# Altium schematic sheet IndAlarmIf2.SCHDOC
size B
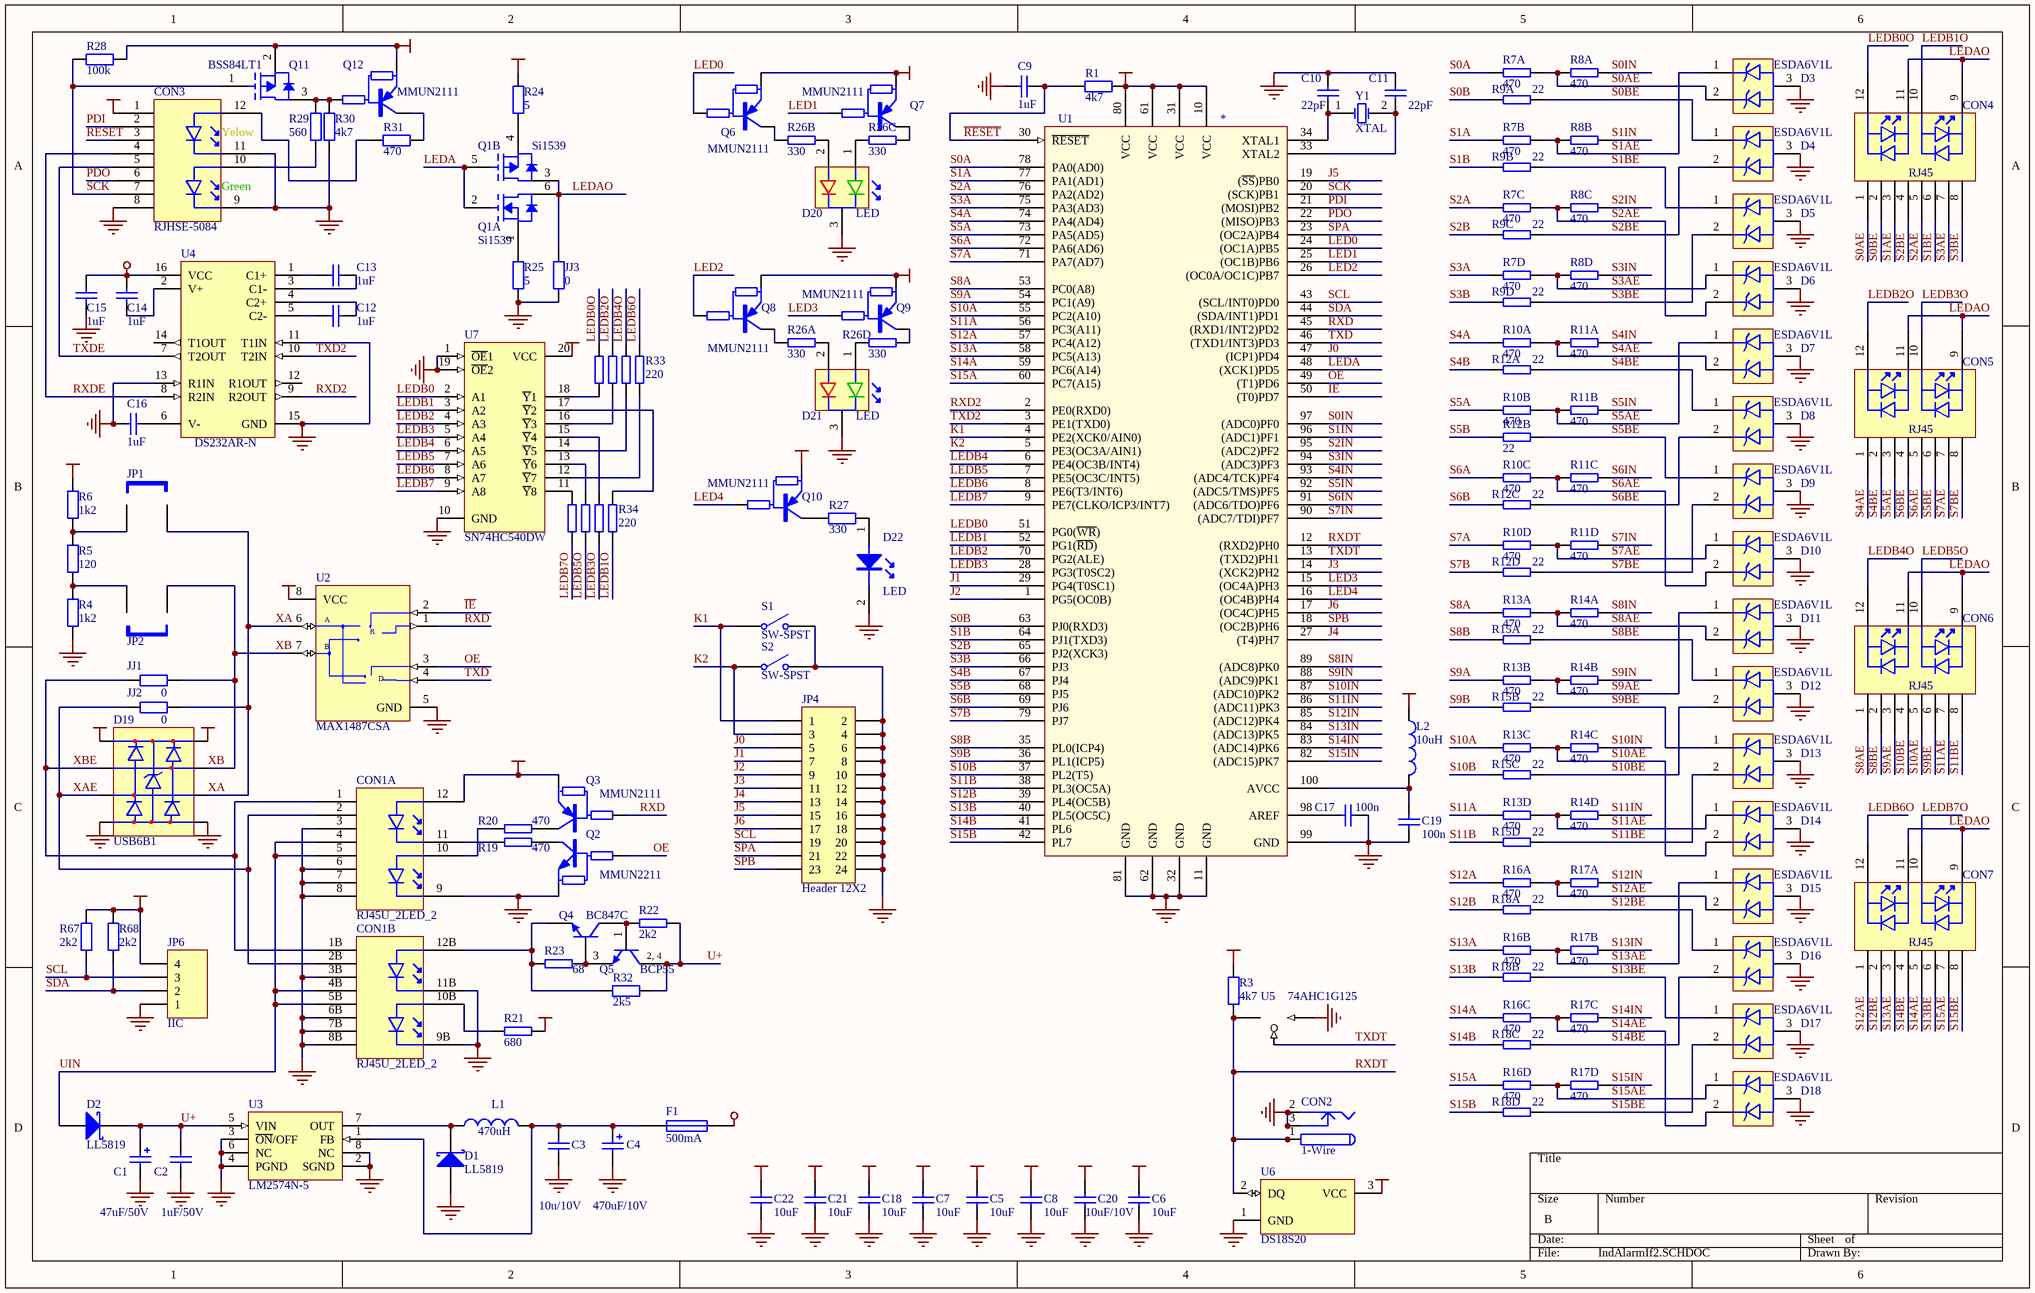
[diagram p0: IndAlarmIf2.SCHDOC]

## Parts
C1  value 47uF/50V  [C8X11RM3.5]  (hidden comment: Cap Pol1)
C2  value 1uF/50V  [CC3225-1210]  (hidden comment: Cap Semi)
C3  value 10u/10V  [CC3225-1210]  (hidden comment: Cap Semi)
C4  value 470uF/10V  [C8X11RM3.5]  (hidden comment: Cap Pol1)
C5  value 10uF  [CC3216-1206]  (hidden comment: Cap Semi)
C6  value 10uF  [CC3216-1206]  (hidden comment: Cap Semi)
C7  value 10uF  [CC3216-1206]  (hidden comment: Cap Semi)
C8  value 10uF  [CC3225-1210]  (hidden comment: Cap Semi)
C9  value 1uF  [CC2012-0805]  (hidden comment: Cap Semi)
C10  value 22pF  [CC2012-0805]  (hidden comment: Cap Semi)
C11  value 22pF  [CC2012-0805]  (hidden comment: Cap Semi)
C12  value 1uF  [CC2012-0805]  (hidden comment: Cap Semi)
C13  value 1uF  [CC2012-0805]  (hidden comment: Cap Semi)
C14  value 1uF  [CC2012-0805]  (hidden comment: Cap Semi)
C15  value 1uF  [CC3216-1206]  (hidden comment: Cap Semi)
C16  value 1uF  [CC2012-0805]  (hidden comment: Cap Semi)
C17  value 100n  [CC2012-0805]  (hidden comment: Cap Semi)
C18  value 10uF  [CC3216-1206]  (hidden comment: Cap Semi)
C19  value 100n  [CC3216-1206]  (hidden comment: Cap Semi)
C20  value 10uF/10V  [CC3216-1206]  (hidden comment: Cap Semi)
C21  value 10uF  [CC3216-1206]  (hidden comment: Cap Semi)
C22  value 10uF  [CC3216-1206]  (hidden comment: Cap Semi)
CON1  RJ45U_2LED_2  [RJHS-508x-2]  (parts A,B of 2)
CON2  1-Wire  [KLD-0202]
CON3  RJHSE-5084  [RJHS-508x]
CON4  RJ45  [RJHS-508x]
CON5  RJ45  [RJHS-508x]
CON6  RJ45  [RJHS-508x]
CON7  RJ45  [RJHS-508x]
D1  LL5819  [MELF]
D2  LL5819  [MELF]
D3  ESDA6V1L  [SO-G3/C2.5]
D4  ESDA6V1L  [SO-G3/C2.5]
D5  ESDA6V1L  [SO-G3/C2.5]
D6  ESDA6V1L  [SO-G3/C2.5]
D7  ESDA6V1L  [SO-G3/C2.5]
D8  ESDA6V1L  [SO-G3/C2.5]
D9  ESDA6V1L  [SO-G3/C2.5]
D10  ESDA6V1L  [SO-G3/C2.5]
D11  ESDA6V1L  [SO-G3/C2.5]
D12  ESDA6V1L  [SO-G3/C2.5]
D13  ESDA6V1L  [SO-G3/C2.5]
D14  ESDA6V1L  [SO-G3/C2.5]
D15  ESDA6V1L  [SO-G3/C2.5]
D16  ESDA6V1L  [SO-G3/C2.5]
D17  ESDA6V1L  [SO-G3/C2.5]
D18  ESDA6V1L  [SO-G3/C2.5]
D19  USB6B1  [NSO8]
D20  LED  [LED3mm - 2]
D21  LED  [LED3mm - 2]
D22  LED  [LED3mm]
F1  500mA  [minifuse]
JJ1  value 0  [CR2012-0805]
JJ2  value 0  [CR2012-0805]
JJ3  value 0  [CR2012-0805]
JP1  Jumper  [JP]  (value not drawn)
JP2  Jumper  [JP]  (value not drawn)
JP4  Header 12X2  [HDR2X12]
JP6  IIC  [HDR1X4]
L1  value 470uH  [SSL1306T - NPI27H]  (hidden comment: Inductor)
L2  value 10uH  [CR3225-1210]  (hidden comment: Inductor)
Q1  Si1539  [SOT363]  (parts A,B of 2)
Q2  MMUN2211  [SOT-23]
Q3  MMUN2111  [SOT-23]
Q4  BC847C  [318-08]
Q5  BCP55  [SOT223]
Q6  MMUN2111  [SOT-23]
Q7  MMUN2111  [SOT-23]
Q8  MMUN2111  [SOT-23]
Q9  MMUN2111  [SOT-23]
Q10  MMUN2111  [SOT-23]
Q11  BSS84LT1  [SOT23]
Q12  MMUN2111  [SOT-23]
R1  value 4k7  [CR2012-0805]  (hidden comment: Res Semi)
R3  value 4k7  [CR2012-0805]  (hidden comment: Res Semi)
R4  value 1k2  [CR2012-0805]  (hidden comment: Res Semi)
R5  value 120  [CR5025-2010]  (hidden comment: Res Semi)
R6  value 1k2  [CR2012-0805]  (hidden comment: Res Semi)
R7  470  [YC164]  (parts A,B,C,D of 4)
R8  470  [YC164]  (parts A,B,C,D of 4)
R9  22  [YC164]  (parts A,B,C,D of 4)
R10  470  [YC164]  (parts A,B,C,D of 4)
R11  470  [YC164]  (parts A,B,C,D of 4)
R12  22  [YC164]  (parts A,B,C,D of 4)
R13  470  [YC164]  (parts A,B,C,D of 4)
R14  470  [YC164]  (parts A,B,C,D of 4)
R15  22  [YC164]  (parts A,B,C,D of 4)
R16  470  [YC164]  (parts A,B,C,D of 4)
R17  470  [YC164]  (parts A,B,C,D of 4)
R18  22  [YC164]  (parts A,B,C,D of 4)
R19  470  [CR2012-0805]
R20  470  [CR2012-0805]
R21  680  [CR2012-0805]
R22  2k2  [CR2012-0805]
R23  68  [CR2012-0805]
R24  value 5  [CR5025-2010]  (hidden comment: Res Semi)
R25  value 5  [CR5025-2010]  (hidden comment: Res Semi)
R26  330  [YC164]  (parts A,B,C,D of 4)
R27  value 330  [CR2012-0805]  (hidden comment: Res Semi)
R28  value 100k  [CR2012-0805]  (hidden comment: Res Semi)
R29  value 560  [CR2012-0805]  (hidden comment: Res Semi)
R30  value 4k7  [CR2012-0805]  (hidden comment: Res Semi)
R31  value 470  [CR2012-0805]  (hidden comment: Res Semi)
R32  value 2k5  [CR5025-2010]  (hidden comment: Res Semi)
R33  220  [YC164]
R34  220  [YC164]
R67  value 2k2  [CR2012-0805]  (hidden comment: Res Semi)
R68  value 2k2  [CR2012-0805]  (hidden comment: Res Semi)
S1  SW-SPST  [AXIAL-0.6]
S2  SW-SPST  [AXIAL-0.6]
U1  *  [TQFP100]
U2  MAX1487CSA  [NSO8]
U3  LM2574N-5  [626-05]
U4  DS232AR-N  [SOIC16N]
U5  74AHC1G125  [SOT353]
U6  DS18S20  [PR35]
U7  SN74HC540DW  [DW020]
Y1  XTAL  [HC49]

## Nets
GND: C1.2 C2.1 C3.1 C4.2 C5.1 C6.1 C7.1 C8.1 C9.2 C10.2 C11.2 C15.2 C16.1 C17.1 C18.1 C19.1 C20.1 C21.1 C22.1 CON1.3 CON1.3B CON1.6 CON1.6B CON1.7 CON1.7B CON1.8 CON1.8B CON1.9 CON1.9B CON1.11B CON2.2 CON2.2A CON2.2B CON2.3 CON2.3A CON2.3B CON3.8 CON3.9 CON3.11 D1.1(A) D3.3 D4.3 D5.3 D6.3 D7.3 D8.3 D9.3 D10.3 D11.3 D12.3 D13.3 D14.3 D15.3 D16.3 D17.3 D18.3 D19.4(GND) D19.5(GND) D20.3 D21.3 D22.2 JJ3.1 JP4.2 JP4.4 JP4.6 JP4.8 JP4.10 JP4.12 JP4.14 JP4.16 JP4.18 JP4.20 JP4.22 JP4.24 JP6.1 Q2.2(E) R4.1 R25.1 R30.1 S1.2(NO) S2.2(NO) U1.11(GND) U1.32(GND) U1.62(GND) U1.81(GND) U1.99(GND) U2.5(GND) U3.2(SGND) U3.3(~{ON}/OFF) U3.4(PGND) U3.6(NC) U3.8(NC) U4.11(T1IN) U4.13(R1IN) U4.15(GND) U5.2(A) U5.3(GND) U6.1(GND) U7.1(~{OE}1) U7.10(GND) U7.19(~{OE}2)
VCC: C5.2 C6.2 C7.2 C8.2 C14.1 C15.1 C18.2 C20.2 C21.2 C22.2 CON1.12 CON3.1 D19.1(VCC) D19.8(VCC) F1.2 JP6.4 L2.1 Q3.2(E) Q6.2(E) Q7.2(E) Q8.2(E) Q9.2(E) Q10.2(E) Q11.2(S) Q12.2(E) R1.2 R3.2 R6.1 R21.2 R24.2 R28.2 R67.2 R68.2 U1.10(VCC) U1.31(VCC) U1.61(VCC) U1.80(VCC) U2.8(VCC) U4.16(VCC) U5.5(VCC) U6.3(VCC) U7.20(VCC)
~{IE}: U1.50((T0)PD7) U2.2(~{RE})
J0: JP4.5 U1.47((ICP1)PD4)
J1: JP4.7 U1.29(PG4(T0SC1))
J2: JP4.9 U1.1(PG5(OC0B))
J3: JP4.11 U1.14((XCK2)PH2)
J4: JP4.13 U1.27((T4)PH7)
J5: JP4.15 U1.19((~{SS})PB0)
J6: JP4.17 U1.17((OC4C)PH5)
K1: JP4.1 S1.1(COMMON) U1.4(PE2(XCK0/AIN0))
K2: JP4.3 S2.1(COMMON) U1.5(PE3(OC3A/AIN1))
LED0: Q6.1(B) U1.24((OC1A)PB5)
LED1: Q7.1(B) U1.25((OC1B)PB6)
LED2: Q8.1(B) U1.26((OC0A/OC1C)PB7)
LED3: Q9.1(B) U1.15((OC4A)PH3)
LED4: Q10.1(B) U1.16((OC4B)PH4)
LEDA: Q1.2(G1) Q1.5(G2) U1.48((XCK1)PD5)
LEDAO: CON4.9 CON4.11 CON5.9 CON5.11 CON6.9 CON6.11 CON7.9 CON7.11 JJ3.2 Q1.3(D2) Q1.6(D1)
LEDB0: U1.51(PG0(~{WR})) U7.2(A1)
LEDB0O: CON4.12 R33.8
LEDB1: U1.52(PG1(~{RD})) U7.3(A2)
LEDB1O: CON4.10 R34.5
LEDB2: U1.70(PG2(ALE)) U7.4(A3)
LEDB2O: CON5.12 R33.7
LEDB3: U1.28(PG3(T0SC2)) U7.5(A4)
LEDB3O: CON5.10 R34.6
LEDB4: U1.6(PE4(OC3B/INT4)) U7.6(A5)
LEDB4O: CON6.12 R33.6
LEDB5: U1.7(PE5(OC3C/INT5)) U7.7(A6)
LEDB5O: CON6.10 R34.7
LEDB6: U1.8(PE6(T3/INT6)) U7.8(A7)
LEDB6O: CON7.12 R33.5
LEDB7: U1.9(PE7(CLKO/ICP3/INT7)) U7.9(A8)
LEDB7O: CON7.10 R34.8
OE: Q2.1(B) U1.49((T1)PD6) U2.3(DE)
PDI: CON3.2 U1.21((MOSI)PB2)
PDO: CON3.6 U1.22((MISO)PB3)
~{RESET}: C9.1 CON3.3 R1.1 U1.30(~{RESET})
RXD: Q3.1(B) U1.45((RXD1/INT2)PD2) U2.1(RO)
RXD2: U1.2(PE0(RXD0)) U4.9(R2OUT)
RXDE: CON3.4 U4.8(R2IN)
RXDT: CON2.1 CON2.1A CON2.1B R3.1 U1.12((RXD2)PH0) U5.4(Y) U6.2(DQ)
S0A: R7.8 U1.78(PA0(AD0))
S0AE: CON4.1 D3.2 R7.1 R8.8
S0B: R9.1 U1.63(PJ0(RXD3))
S0BE: CON4.2 D4.1 R9.8
S0IN: R8.1 U1.97((ADC0)PF0)
S1A: R7.7 U1.77(PA1(AD1))
S1AE: CON4.3 D3.1 R7.2 R8.7
S1B: R9.2 U1.64(PJ1(TXD3))
S1BE: CON4.6 D5.1 R9.7
S1IN: R8.2 U1.96((ADC1)PF1)
S2A: R7.6 U1.76(PA2(AD2))
S2AE: CON4.5 D6.2 R7.3 R8.6
S2B: R9.3 U1.65(PJ2(XCK3))
S2BE: CON4.4 D4.2 R9.6
S2IN: R8.3 U1.95((ADC2)PF2)
S3A: R7.5 U1.75(PA3(AD3))
S3AE: CON4.7 D6.1 R7.4 R8.5
S3B: R9.4 U1.66(PJ3)
S3BE: CON4.8 D5.2 R9.5
S3IN: R8.4 U1.94((ADC3)PF3)
S4A: R10.8 U1.74(PA4(AD4))
S4AE: CON5.1 D7.2 R10.1 R11.8
S4B: R12.1 U1.67(PJ4)
S4BE: CON5.2 D8.1 R12.8
S4IN: R11.1 U1.93((ADC4/TCK)PF4)
S5A: R10.7 U1.73(PA5(AD5))
S5AE: CON5.3 D7.1 R10.2 R11.7
S5B: R12.2 U1.68(PJ5)
S5BE: CON5.6 D9.1 R12.7
S5IN: R11.2 U1.92((ADC5/TMS)PF5)
S6A: R10.6 U1.72(PA6(AD6))
S6AE: CON5.5 D10.2 R10.3 R11.6
S6B: R12.3 U1.69(PJ6)
S6BE: CON5.4 D8.2 R12.6
S6IN: R11.3 U1.91((ADC6/TDO)PF6)
S7A: R10.5 U1.71(PA7(AD7))
S7AE: CON5.7 D10.1 R10.4 R11.5
S7B: R12.4 U1.79(PJ7)
S7BE: CON5.8 D9.2 R12.5
S7IN: R11.4 U1.90((ADC7/TDI)PF7)
S8A: R13.8 U1.53(PC0(A8))
S8AE: CON6.1 D11.2 R13.1 R14.8
S8B: R15.1 U1.35(PL0(ICP4))
S8BE: CON6.2 D12.1 R15.8
S8IN: R14.1 U1.89((ADC8)PK0)
S9A: R13.7 U1.54(PC1(A9))
S9AE: CON6.3 D11.1 R13.2 R14.7
S9B: R15.2 U1.36(PL1(ICP5))
S9BE: CON6.6 D13.1 R15.7
S9IN: R14.2 U1.88((ADC9)PK1)
S10A: R13.6 U1.55(PC2(A10))
S10AE: CON6.5 D14.2 R13.3 R14.6
S10B: R15.3 U1.37(PL2(T5))
S10BE: CON6.4 D12.2 R15.6
S10IN: R14.3 U1.87((ADC10)PK2)
S11A: R13.5 U1.56(PC3(A11))
S11AE: CON6.7 D14.1 R13.4 R14.5
S11B: R15.4 U1.38(PL3(OC5A))
S11BE: CON6.8 D13.2 R15.5
S11IN: R14.4 U1.86((ADC11)PK3)
S12A: R16.8 U1.57(PC4(A12))
S12AE: CON7.1 D15.2 R16.1 R17.8
S12B: R18.1 U1.39(PL4(OC5B))
S12BE: CON7.2 D16.1 R18.8
S12IN: R17.1 U1.85((ADC12)PK4)
S13A: R16.7 U1.58(PC5(A13))
S13AE: CON7.3 D15.1 R16.2 R17.7
S13B: R18.2 U1.40(PL5(OC5C))
S13BE: CON7.6 D17.1 R18.7
S13IN: R17.2 U1.84((ADC13)PK5)
S14A: R16.6 U1.59(PC6(A14))
S14AE: CON7.5 D18.2 R16.3 R17.6
S14B: R18.3 U1.41(PL6)
S14BE: CON7.4 D16.2 R18.6
S14IN: R17.3 U1.83((ADC14)PK6)
S15A: R16.5 U1.60(PC7(A15))
S15AE: CON7.7 D18.1 R16.4 R17.5
S15B: R18.4 U1.42(PL7)
S15BE: CON7.8 D17.2 R18.5
S15IN: R17.4 U1.82((ADC15)PK7)
SCK: CON3.7 Q11.1(G) R28.1 U1.20((SCK)PB1)
SCL: JP4.19 JP6.3 R67.1 U1.43((SCL/INT0)PD0)
SDA: JP6.2 R68.1 U1.44((SDA/INT1)PD1)
SPA: JP4.21 U1.23((OC2A)PB4)
SPB: JP4.23 U1.18((OC2B)PH6)
TXD: U1.46((TXD1/INT3)PD3) U2.4(DI)
TXD2: U1.3(PE1(TXD0)) U4.10(T2IN)
TXDE: CON3.5 U4.7(T2OUT)
TXDT: U1.13((TXD2)PH1) U5.1(~{OE})
U+: C1.1 C2.2 D2.2(K) Q5.2(C) Q5.4(C) R22.2 R32.1 U3.5(VIN)
UIN: CON1.4 CON1.4B CON1.5 CON1.5B D2.1(A)
XA: D19.3(I/O2) JJ2.2 JP1.2 U2.6(A)
XAE: CON1.2 CON1.2B D19.6(I/O2) JJ2.1
XB: D19.2(I/O1) JJ1.2 JP2.1 U2.7(B)
XBE: CON1.1 CON1.1B D19.7(I/O1) JJ1.1
NetC3_2: C3.2 C4.1 F1.1 L1.2 U3.1(FB)
NetC10_1: C10.1 U1.34(XTAL1) Y1.1(OSC1)
NetC11_1: C11.1 U1.33(XTAL2) Y1.2(OSC2)
NetC12_1: C12.1 U4.5(C2-)
NetC12_2: C12.2 U4.4(C2+)
NetC13_1: C13.1 U4.1(C1+)
NetC13_2: C13.2 U4.3(C1-)
NetC14_2: C14.2 U4.2(V+)
NetC16_2: C16.2 U4.6(V-)
NetC17_2: C17.2 U1.98(AREF)
NetC19_2: C19.2 L2.2 U1.100(AVCC)
NetCON1_10: CON1.10 R20.1
NetCON1_10B: CON1.10B R21.1
NetCON1_11: CON1.11 R19.1
NetCON1_12B: CON1.12B Q4.2(E) R23.1 R32.2
NetCON3_10: CON3.10 R29.1
NetCON3_12: CON3.12 R31.1
NetD1_2: D1.2(K) L1.1 U3.7(OUT)
NetD20_1: D20.1 R26.3
NetD20_2: D20.2 R26.2
NetD21_1: D21.1 R26.4
NetD21_2: D21.2 R26.1
NetD22_1: D22.1 R27.1
NetJP1_1: JP1.1 R5.2 R6.2
NetJP2_2: JP2.2 R4.2 R5.1
NetQ1_1: Q1.1(S1) R25.2
NetQ1_4: Q1.4(S2) R24.1
NetQ2_3: Q2.3(C) R19.2
NetQ3_3: Q3.3(C) R20.2
NetQ4_1: Q4.1(B) Q5.3(E) R23.2
NetQ4_3: Q4.3(C) Q5.1(B) R22.1
NetQ6_3: Q6.3(C) R26.7
NetQ7_3: Q7.3(C) R26.6
NetQ8_3: Q8.3(C) R26.8
NetQ9_3: Q9.3(C) R26.5
NetQ10_3: Q10.3(C) R27.2
NetQ11_3: Q11.3(D) Q12.1(B) R29.2 R30.2
NetQ12_3: Q12.3(C) R31.2
NetR33_1: R33.1 U7.18(~{Y}1)
NetR33_2: R33.2 U7.16(~{Y}3)
NetR33_3: R33.3 U7.14(~{Y}5)
NetR33_4: R33.4 U7.12(~{Y}7)
NetR34_1: R34.1 U7.11(~{Y}8)
NetR34_2: R34.2 U7.13(~{Y}6)
NetR34_3: R34.3 U7.15(~{Y}4)
NetR34_4: R34.4 U7.17(~{Y}2)

Not connected (* = marked no-connect by the designer): U4 12(R1OUT) 14(T1OUT)

## Notes on the sheet
- (near CON3) Yelow
- (near CON3) Green
- (in symbol BCP55) 2, 4
- (in symbol MAX1487CSA) R; D

## Library data of the parts
C1 C4 = Cap Pol1: Polarized Capacitor (Radial); Published: 8-Jun-2000; Revision: July-2002: Re-released for DXP Platform.; Publisher: Altium Limited
C2 C3 C5-C22 = Cap Semi: Capacitor (Semiconductor SIM Model); Published: 8-Jun-2000; Revision: July-2002: Re-released for DXP Platform.; Publisher: Altium Limited
CON2 = PWR2.5: Low Voltage Power Supply Connector; Published: 17-Dec-2003; Datasheet: Latest Revision: 09-May-2002; Publisher: Altium Limited
CON3 = RJ45U_2LED
CON4-CON7 = RJ45U_2LED_BI
D1 D2 = D Schottky: Schottky Diode; Code - JEDEC: DO-214-AA; Published: 8-Jun-2000; Revision: July-2002: Re-released for DXP Platform.; Publisher: Altium Limited
D3-D18 = ESDA6V1L: DUAL TRANSIL ARRAY / FOR ESD PROTECTION
D20 D21 = 2LED_A
D22 = LED12
F1 = Fuse 1: Fuse; Published: 8-Jun-2000; Revision: July-2002: Re-released for DXP Platform.; Publisher: Altium Limited
JJ1-JJ3 R1 R3-R6 R24 R25 R27-R32 R67 R68 = Res Semi: Semiconductor Resistor; Published: 8-Jun-2000; Revision: July-2002: Re-released for DXP Platform.; Publisher: Altium Limited
JP1 JP2 = Jumper: Jumper Wire; Published: 24-Mar-1999; Revision: July-2002: Re-released for DXP Platform.; Publisher: Altium Limited
JP4 = Header 12X2: Header, 12-Pin, Dual row; Revision: 17-Jul-2002: Re-released for DXP Platform.; Publisher: Altium Limited
JP6 = Header 4: Header, 4-Pin; Revision: 17-Jul-2002: Re-released for DXP Platform.; Publisher: Altium Limited
Q2 = NPNR1: NPN Transistor
Q3 Q6-Q10 Q12 = PNPR1: NPN Transistor
Q4 = BC847ALT1: General Purpose Transistor NPN Silicon; Package Information: Latest Revision: 1997; Published: 29-Sep-2000; Revision: 17-Jul-2002: Re-released for DXP Platform.; Datasheet: Latest Revision: 1997; Package Reference: 318-08; Publisher: Altium Limited
Q5 = BCP55: NPN Medium Power Transistor; Package Information: Latest Revision: Aug-2001; Published: 17-Sep-2003; Datasheet: Latest Revision: 10-Oct-2001; Package Reference: SOT223; Publisher: Altium Limited
R7-R18 R26 = RES4_1
R19-R23 = RES2
R33 R34 = RES4
S1 S2 = SW-SPST: Single-Pole, Single-Throw Switch; Published: 24-Mar-1999; Revision: July-2002: Re-released for DXP Platform.; Publisher: Altium Limited
U1 = ATMEGA1280
U2 = MAX1487CSA: Low-Power, Slew-Rate-Limited RS-485/RS-422 Transceiver; Code - JEDEC: MS-012-AA; Code - IPC: SO8; Published: 16-Jan-2001; Revision: 17-Jul-2002: Re-released for DXP Platform.; Datasheet: Latest Revision: Feb-1996; Package Reference: NSO8; Publisher: Altium Limited
U3 = LM2574N-5: Easy Switcher 0.5A Step-Down Voltage Regulator; Package Information: Latest Revision: 1998; Published: 15-Apr-2002; Datasheet: Latest Revision: Jul-1999; Package Reference: 626-05; Publisher: Altium Limited
U4 = DS232AR-N: Dual RS-232 Transmitter/Receiver; Package Information: Latest Revision: 1999; Published: 13-Oct-2000; Revision: 17-Jul-2002: Re-released for DXP Platform.; Datasheet: Latest Revision: 19-Feb-1998; Package Reference: SOIC16N; Publisher: Altium Limited
U6 = DS1820: 1-Wire Digital Thermometer; Package Information: Latest Revision: 1999; Published: 13-Oct-2000; Revision: 17-Jul-2002: Re-released for DXP Platform.; Datasheet: Latest Revision: 5-Mar-1998; Package Reference: PR35; Publisher: Altium Limited
U7 = SN74HC540DW: Octal Buffer and Line Driver with 3-State Outputs; Package Information: Latest Revision: Mar-2000; Code - JEDEC: MS-013; Published: 8-Jun-2000; Revision: 17-Jul-2002: Re-released for DXP Platform.; Datasheet: Latest Revision: May-1997; Package Reference: DW020; Publisher: Altium Limited
Y1 = XTAL: Crystal Oscillator; Published: 8-Jun-2000; Revision: July-2002: Re-released for DXP Platform.; Publisher: Altium Limited
L1 L2 = Inductor: Published: 8-Jun-2000; Revision: July-2002: Re-released for DXP Platform.; Publisher: Altium Limited